# Altium schematic sheet RotaryController2.SchDoc
size A4
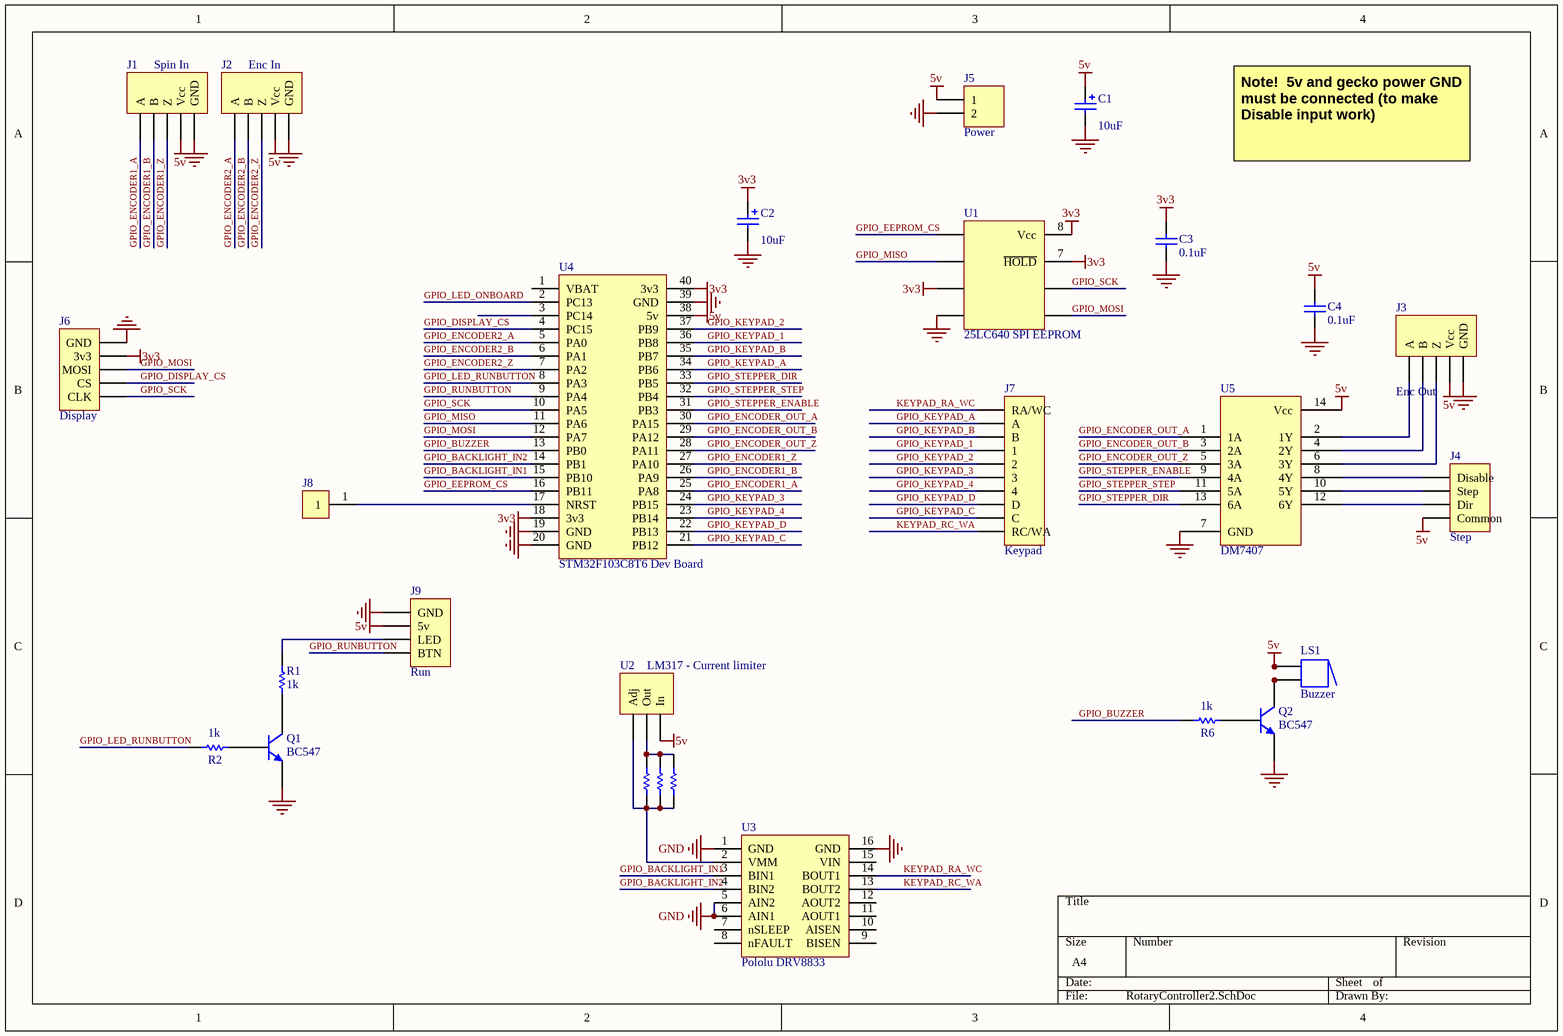
[diagram p0: RotaryController2.SchDoc]

## Parts
C1  value 10uF  [Cap Cyl 14x5 2.5]  (hidden comment: Cap Pol)
C2  value 10uF  [Cap Cyl 14x5 2.5]  (hidden comment: Cap Pol)
C3  value 0.1uF  [Cap Monolithic 2.5]  (hidden comment: Cap)
C4  value 0.1uF  [Cap Monolithic 2.5]  (hidden comment: Cap)
J1  Spin In  [0.1 SIP 5 PIN]
J2  Enc In  [0.1 SIP 5 PIN]
J3  Enc Out  [0.1 SIP 5 PIN]
J4  Step  [0.1 SIP 4 PIN]
J5  Power  [0.156 SIP 2 PIN]
J6  Display  [0.1 SIP 5 PIN]
J7  Keypad  [0.1 SIP 10 PIN]
J8  HDR 1  [HDR1]  (value not drawn)
J9  Run  [0.1 SIP 4 PIN]
LS1  Buzzer  [Buzzer Mini PC Mount Piezo 14x7.5]
Q1  BC547  [TO-92 0.05"]
Q2  BC547  [TO-92 0.05"]
R1  value 1k  [Resistor Axial 1/4W 0.4]  (hidden comment: Res1)
R2  value 1k  [Resistor Axial 1/4W 0.4]  (hidden comment: Res1)
R3  Res1  [Resistor Axial 1/4W 0.4]  (value not drawn)
R4  Res1  [Resistor Axial 1/4W 0.4]  (value not drawn)
R5  Res1  [Resistor Axial 1/4W 0.4]  (value not drawn)
R6  value 1k  [Resistor Axial 1/4W 0.4]  (hidden comment: Res1)
U1  25LC640 SPI EEPROM  [DIP8]
U2  LM317 - Current limiter  [TO-220]
U3  Pololu DRV8833  [Pololu DRV8833]
U4  STM32F103C8T6 Dev Board  [STM32F103C8T6 Dev Board]
U5  DM7407  [DIP14]

## Nets
3v3: C2.1 C3.2 J6.4(3v3) U1.3(~{WP}) U1.7(~{HOLD}) U1.8(Vcc) U4.18(3v3) U4.40(3v3)
5v: C1.1 C4.2 J1.4(Vcc) J2.4(Vcc) J3.4(Vcc) J4.4(Common) J5.1 J9.2(5v) LS1.1 LS1.1A U2.3(In) U4.38(5v) U5.14(Vcc)
GND: C1.2 C2.2 C3.1 C4.1 J1.5(GND) J2.5(GND) J3.5(GND) J5.2 J6.5(GND) J9.1(GND) Q1.E Q2.E U1.4(Vss) U3.1(GND) U3.5(AIN2) U3.6(AIN1) U3.16(GND) U4.19(GND) U4.20(GND) U4.39(GND) U5.7(GND)
GPIO_BACKLIGHT_IN1: U3.3(BIN1) U4.15(PB10)
GPIO_BACKLIGHT_IN2: U3.4(BIN2) U4.14(PB1)
GPIO_BUZZER: R6.1 U4.13(PB0)
GPIO_DISPLAY_CS: J6.2(CS) U4.4(PC15)
GPIO_EEPROM_CS: U1.1(~{CS}) U4.16(PB11)
GPIO_ENCODER1_A: J1.1(A) U4.25(PA8)
GPIO_ENCODER1_B: J1.2(B) U4.26(PA9)
GPIO_ENCODER1_Z: J1.3(Z) U4.27(PA10)
GPIO_ENCODER2_A: J2.1(A) U4.5(PA0)
GPIO_ENCODER2_B: J2.2(B) U4.6(PA1)
GPIO_ENCODER2_Z: J2.3(Z) U4.7(PA2)
GPIO_ENCODER_OUT_A: U4.30(PA15) U5.1(1A)
GPIO_ENCODER_OUT_B: U4.29(PA12) U5.3(2A)
GPIO_ENCODER_OUT_Z: U4.28(PA11) U5.5(3A)
GPIO_KEYPAD_1: J7.4(1) U4.36(PB8)
GPIO_KEYPAD_2: J7.5(2) U4.37(PB9)
GPIO_KEYPAD_3: J7.6(3) U4.24(PB15)
GPIO_KEYPAD_4: J7.7(4) U4.23(PB14)
GPIO_KEYPAD_A: J7.2(A) U4.34(PB6)
GPIO_KEYPAD_B: J7.3(B) U4.35(PB7)
GPIO_KEYPAD_C: J7.9(C) U4.21(PB12)
GPIO_KEYPAD_D: J7.8(D) U4.22(PB13)
GPIO_LED_ONBOARD: U4.2(PC13)
GPIO_LED_RUNBUTTON: R2.1 U4.8(PA3)
GPIO_MISO: U1.2(SO) U4.11(PA6)
GPIO_MOSI: J6.3(MOSI) U1.5(SI) U4.12(PA7)
GPIO_RUNBUTTON: J9.4(BTN) U4.9(PA4)
GPIO_SCK: J6.1(CLK) U1.6(SCK) U4.10(PA5)
GPIO_STEPPER_DIR: U4.33(PB5) U5.13(6A)
GPIO_STEPPER_ENABLE: U4.31(PB3) U5.9(4A)
GPIO_STEPPER_STEP: U4.32(PB4) U5.11(5A)
KEYPAD_RA_WC: J7.1(RA/WC) U3.14(BOUT1)
KEYPAD_RC_WA: J7.10(RC/WA) U3.13(BOUT2)
NetJ3_1: J3.1(A) U5.2(1Y)
NetJ3_2: J3.2(B) U5.4(2Y)
NetJ3_3: J3.3(Z) U5.6(3Y)
NetJ4_1: J4.1(Disable) U5.8(4Y)
NetJ4_2: J4.2(Step) U5.10(5Y)
NetJ4_3: J4.3(Dir) U5.12(6Y)
NetJ8_1: J8.1 U4.17(NRST)
NetJ9_3: J9.3(LED) R1.1
NetLS1_2: LS1.2 LS1.2A Q2.C
NetQ1_B: Q1.B R2.2
NetQ1_C: Q1.C R1.2
NetQ2_B: Q2.B R6.2
NetR3_1: R3.1 R4.1 R5.1 U2.2(Out)
NetR3_2: R3.2 R4.2 R5.2 U2.1(Adj) U3.2(VMM)

Not connected (* = marked no-connect by the designer): U3 7(nSLEEP) 8(nFAULT) 9(BISEN) 10(AISEN) 11(AOUT1) 12(AOUT2) 15(VIN); U4 1(VBAT) 3(PC14)

## Notes on the sheet
- Note!  5v and gecko power GND must be connected (to make Disable input work)

## Library data of the parts
C1 C2 = Cap Pol: Polarized Capacitor (Radial); Published: 8-Jun-2000; LatestRevisionDate: 17-Jul-2002; LatestRevisionNote: Re-released for DXP Platform.; PackageReference: RB7.6-15; Publisher: Altium Limited; PackageDescription: Polarized Capacitor (Radial); 2 Leads
C3 C4 = Cap: Capacitor; Published: 8-Jun-2000; LatestRevisionDate: 17-Jul-2002; LatestRevisionNote: Re-released for DXP Platform.; PackageReference: RAD-0.3; Publisher: Altium Limited; PackageDescription: Radial Cap, Thru-Hole; 2 Leads; 0.3 in Pin Spacing
J1-J3 J6 = Header 5: Header, 5-Pin; LatestRevisionDate: 17-Jul-2002; LatestRevisionNote: Re-released for DXP Platform.; Publisher: Altium Limited
J4 J9 = Header 4: Header, 4-Pin; LatestRevisionDate: 17-Jul-2002; LatestRevisionNote: Re-released for DXP Platform.; Publisher: Altium Limited
J5 = Header 2: Header, 2-Pin; LatestRevisionDate: 17-Jul-2002; LatestRevisionNote: Re-released for DXP Platform.; Publisher: Altium Limited
J7 = Header 10: Header, 10-Pin; LatestRevisionDate: 17-Jul-2002; LatestRevisionNote: Re-released for DXP Platform.; Publisher: Altium Limited
J8 = Header 1
LS1 = Buzzer: Magnetic Transducer Buzzer; pin to pad: 1A>1 2A>2; Published: 24-Mar-1999; LatestRevisionDate: 17-Dec-2003; LatestRevisionNote: Schematic revised, PCB Footprint replaced.; DatasheetVersion: 17-Dec-2003; PackageReference: ABSM-1574; Publisher: Altium Limited; PackageDescription: Magnetic Transducer Buzzer; ComponentLink1Description: Manufacturer Link; ComponentLink1URL: http://www.megastar.com/linecard/buzzmode/index.php
Q1 Q2 = MMBT100A: General Purpose Amplifier NPN Silicon; pin to pad: B>2 C>1 E>3; Package Information: Latest Revision: 1997; Published: 29-Sep-2000; Revision: 17-Jul-2002: Re-released for DXP Platform.; Datasheet: Latest Revision: 1996; Package Reference: 318-08; Publisher: Altium Limited
R1 R2 R6 = Resistor
R3-R5 = Resistor: Value: 30Ohm 1W
U1 = 25LC640
U2 = Header 3: Header, 3-Pin; LatestRevisionDate: 17-Jul-2002; LatestRevisionNote: Re-released for DXP Platform.; Publisher: Altium Limited
U3 = Pololu DRV8833: Pololu DRV8833 Dual Motor Driver Carrier
U5 = 74xx07: Hex Buffer with Open Collector Outputs